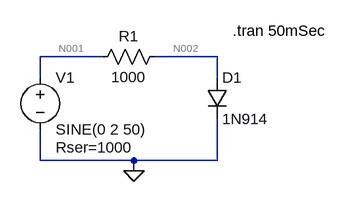
[diagram p0: schematic 9.asc]
9.asc, the LTspice schematic file:
Version 4
SHEET 1 880 680
WIRE 144 32 48 32
WIRE 320 32 224 32
WIRE 48 64 48 32
WIRE 320 64 320 32
WIRE 48 192 48 144
WIRE 192 192 48 192
WIRE 320 192 320 128
WIRE 320 192 192 192
WIRE 192 208 192 192
FLAG 192 208 0
SYMBOL voltage 48 48 R0
WINDOW 123 0 0 Left 0
WINDOW 39 24 124 Left 2
SYMATTR SpiceLine Rser=1000
SYMATTR InstName V1
SYMATTR Value SINE(0 2 50)
SYMBOL diode 304 64 R0
SYMATTR InstName D1
SYMATTR Value 1N914
SYMBOL res 240 16 R90
WINDOW 0 0 56 VBottom 2
WINDOW 3 32 56 VTop 2
SYMATTR InstName R1
SYMATTR Value 1000
TEXT 344 -8 Left 2 !.tran 50mSec

The netlist it stands for:
* 9.asc
V1 N001 0 SINE(0 2 50) Rser=1000
D1 N002 0 1N914
R1 N002 N001 1000
.model D D
.lib standard.dio
.tran 50mSec
.backanno
.end

* Results of the author's LTspice run, read from the files saved beside the schematic
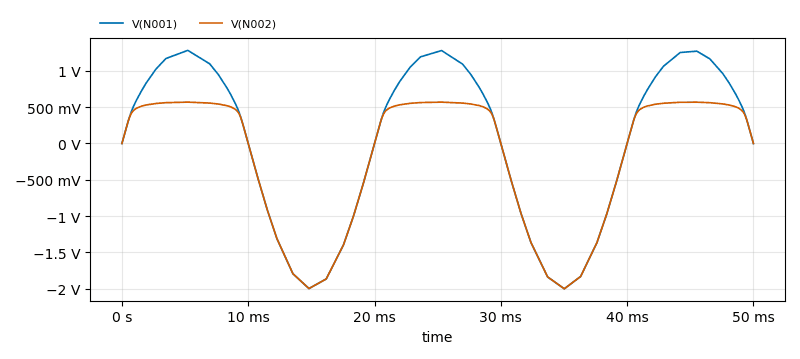
[diagram p1: Transient Analysis of 9.asc, plotted from the saved traces]
* Transient Analysis, 1 run:
*   V(N001): min -2 V, max 1.282 V, average 21.65 mV, rms 1.151 V, last 2.514 µV
*   V(N002): min -2 V, max 569.4 mV, average -208.1 mV, rms 971.1 mV, last 5.027 µV